# EAGLE design cougar_adapter (EAGLE 7.1.0)
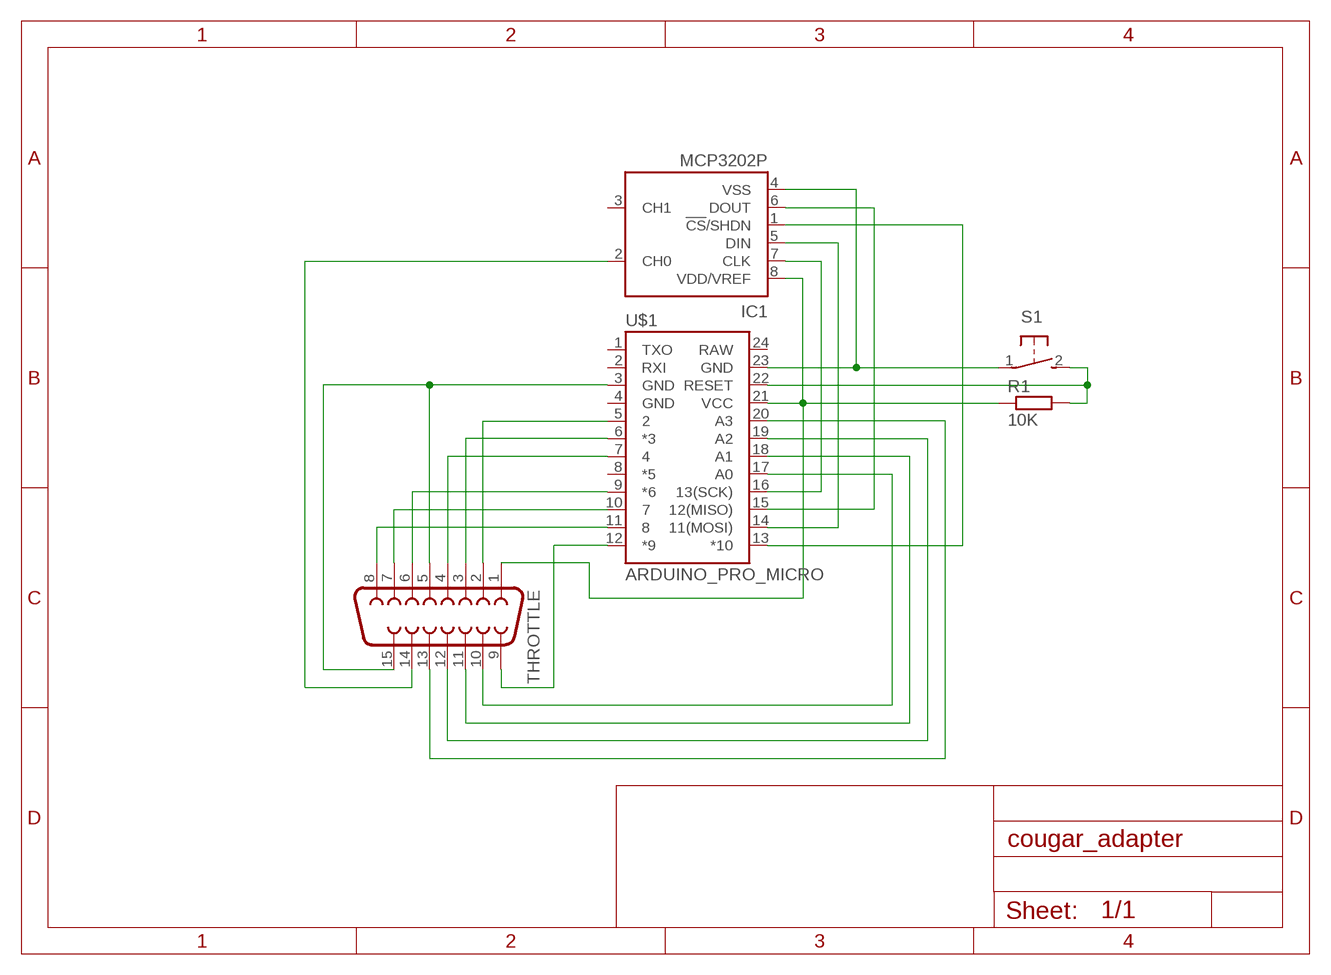
[diagram p0: schematic, sheet 1]

## Parts
IC1  MCP3202P  [DIL8]
R1  10K  R-EU_0204/7  [0204/7]
S1  31-XX  [B3F-31XX]
THROTTLE  F15HDH  [HDF15H]
U$1  ARDUINO_PRO_MICRO  [ARDUINO_PRO_MICRO]

## Nets
5V [Power]: IC1.8(VDD/VREF) R1.1 THROTTLE.1 U$1.21(VCC)
GND [Power]: IC1.4(VSS) S1.1(P) THROTTLE.5 THROTTLE.15 U$1.3(GND) U$1.23(GND)
N$2: IC1.5(DIN) U$1.14(11(MOSI))
N$3: IC1.6(DOUT) U$1.15(12(MISO))
N$4: IC1.7(CLK) U$1.16(13(SCK))
N$6: R1.2 S1.2(S) U$1.22(RESET)
N$7: THROTTLE.8 U$1.11
N$8: THROTTLE.7 U$1.10
N$9: THROTTLE.6 U$1.9(*6)
N$11: THROTTLE.4 U$1.7
N$12: THROTTLE.3 U$1.6(*3)
N$14: IC1.2(CH0) THROTTLE.14
N$15: THROTTLE.9 U$1.12(*9)
N$16: THROTTLE.2 U$1.5
N$17: THROTTLE.10 U$1.17(A0)
N$18: THROTTLE.11 U$1.18(A1)
N$19: THROTTLE.12 U$1.19(A2)
N$20: THROTTLE.13 U$1.20(A3)
N$21: IC1.1(!CS!/SHDN) U$1.13(*10)
Unconnected: IC1.3(CH1) U$1.1(TXO) U$1.2(RXI) U$1.4(GND) U$1.8(*5) U$1.24(RAW)

## Library data of the parts
IC1 = microchip:MCP3202: 2.7V Dual Channel 12-Bit A/D Converter with SPI Serial Interface Source: http://ww1.microchip.com/downloads/en/DeviceDoc/21034D.pdf; MF: MICROCHIP; MPN: MCP3202-CI/P; OC_FARNELL: 1196794; OC_NEWARK: 72K7287
R1 = resistor:R-EU_: RESISTOR, European symbol
S1 = adafruit:31-XX: OMRON SWITCH Now with beefier pads!
THROTTLE = adafruit:F15: SUB-D HDH is also known as a 'right angle VGA' connector
U$1 = SparkFun-Boards:ARDUINO_PRO_MICRO

## Net classes
0 default: width 0.254 mm, drill 0.254 mm, clearance 0.254 mm
1 Power: width 0.406 mm, drill 0.406 mm, clearance 0.406 mm

## Board
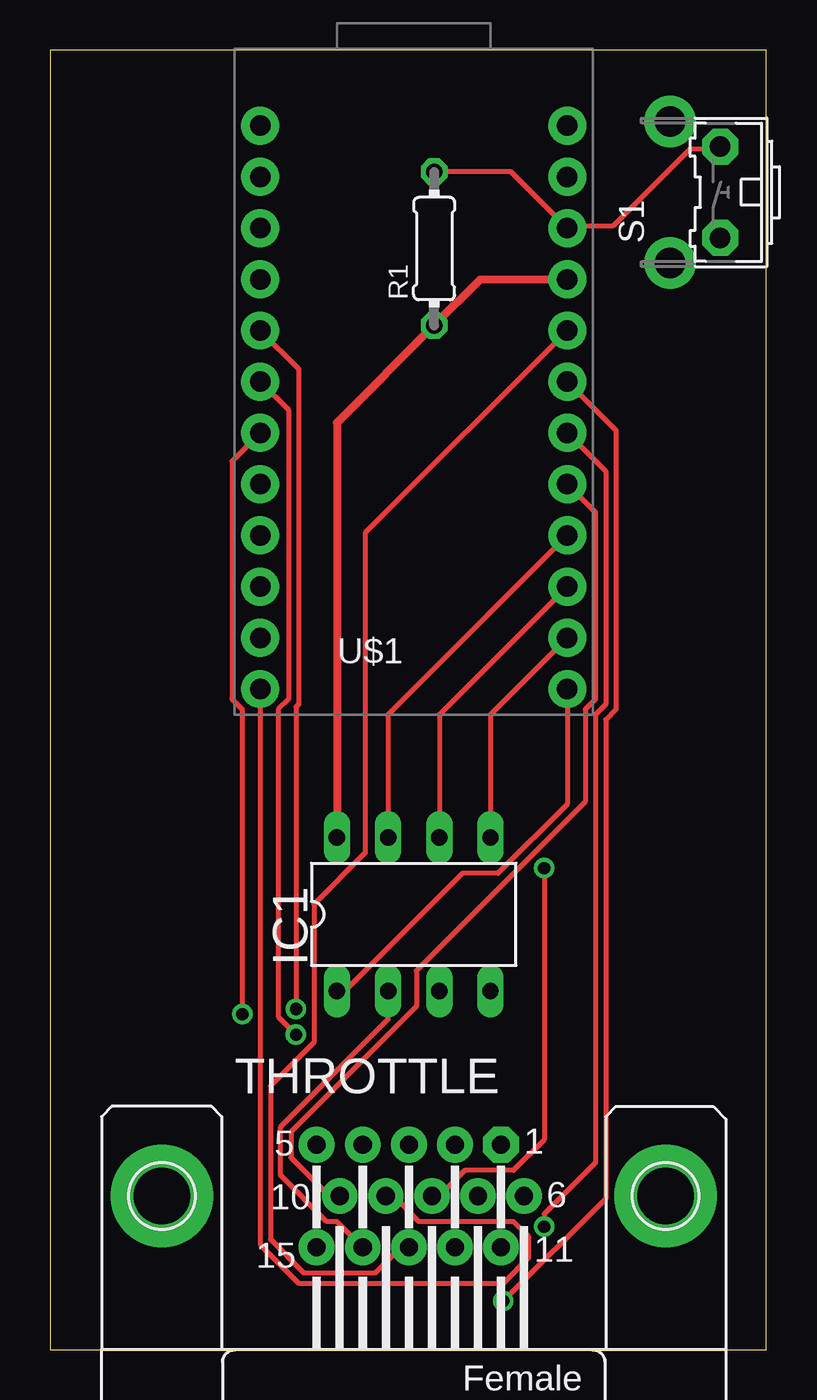
[diagram p1: board, top side]
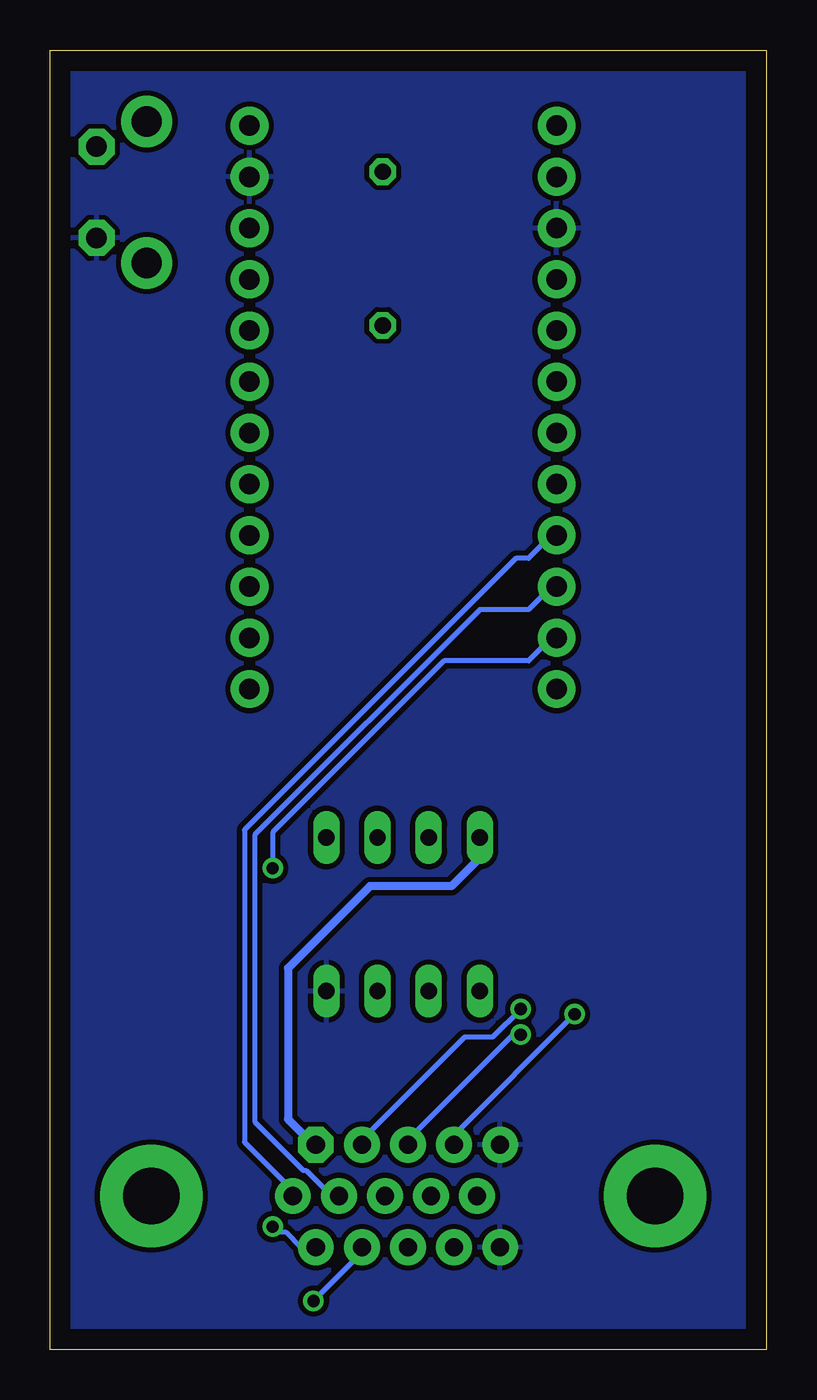
[diagram p2: board, bottom side, seen from below]

Size 35.54 x 64.44 mm. Coordinates in mm from the lower left corner, seen from the top.
Outline: 0,0 35.54,0 35.54,64.44 0,64.44 0,0
Copper layers (1*16): Top 0.035mm / dielectric 1.5mm / Bottom 0.035mm
Design rules "default": minimum track width 10mil, minimum drill 24mil, track to track 8mil, track to pad 8mil, pad to pad 8mil, via to via 8mil, smd to smd 8mil, copper to edge 40mil, drill to drill 8mil, minimum pad ring 10mil, minimum via ring 8mil, stop-mask expansion 4mil, vias tented up to drill 0mil, thermal gap 10mil

### Footprints (pad centres in the part's own frame; a part is rotated, then mirrored left to right if it is on the bottom)
DIL8 = drill 0.813 long: 1 -3.81,-3.81; 2 -1.27,-3.81; 3 1.27,-3.81; 4 3.81,-3.81; 5 3.81,3.81; 6 1.27,3.81; 7 -1.27,3.81; 8 -3.81,3.81
0204/7 = drill 0.813 octagon: 1 -3.81,0; 2 3.81,0
B3F-31XX = drill 1.016 pad 1.778 octagon: 1 -2.261,-1.245; 2 2.261,-1.245 | drill 1.499 pad 2.54: 3 -3.505,1.245; 4 3.505,1.245
HDF15H = drill 0.9 pad 1.778 octagon: 1 4.329,2.54 | drill 0.9 pad 1.778: 2 2.043,2.54; 3 -0.243,2.54; 4 -2.529,2.54; 5 -4.815,2.54; 6 5.472,0; 7 3.186,0; 8 0.9,0; 9 -1.386,0; 10 -3.672,0; 11 4.329,-2.54; 12 2.043,-2.54; 13 -0.243,-2.54; 14 -2.529,-2.54; 15 -4.815,-2.54 | drill 2.8 pad 5.08: P$1 -12.5,0; P$2 12.5,0
ARDUINO_PRO_MICRO = drill 1.016 pad 1.88: 1 -7.62,12.7; 2 -7.62,10.16; 3 -7.62,7.62; 4 -7.62,5.08; 5 -7.62,2.54; 6 -7.62,0; 7 -7.62,-2.54; 8 -7.62,-5.08; 9 -7.62,-7.62; 10 -7.62,-10.16; 11 -7.62,-12.7; 12 -7.62,-15.24; 13 7.62,-15.24; 14 7.62,-12.7; 15 7.62,-10.16; 16 7.62,-7.62; 17 7.62,-5.08; 18 7.62,-2.54; 19 7.62,0; 20 7.62,2.54; 21 7.62,5.08; 22 7.62,7.62; 23 7.62,10.16; 24 7.62,12.7

### Placement (x,y rotation side)
IC1  18.03,21.59 0 top
R1  19.05,54.61 90 top
S1  32,57.4 90 top
THROTTLE  18.03,7.62 0 top
U$1  18.03,48.01 0 top

### Tracks (layer width: path | path; a pad name or v marks a point on that pad's centre or on a via)
5V
  Top 0.406: IC1.8 14.22,45.97 R1.1 21.34,53.09 U$1.21
  Bottom 0.406: IC1.8 14.22,24.38 15.62,22.99 19.68,22.99 23.75,18.92 23.75,11.43 22.48,10.16 THROTTLE.1
GND
  pour Bottom: -2.79,66.04 38.86,66.04 38.86,-4.83 -4.06,-4.83 -4.06,65.53
N$2
  Top 0.254: IC1.5 21.84,31.5 U$1.14
N$3
  Top 0.254: IC1.6 19.3,31.5 U$1.15
N$4
  Top 0.254: IC1.7 16.76,31.5 U$1.16
N$6
  Top 0.254: R1.2 22.86,58.42 U$1.22 25.65,55.75 27.94,55.75 31.75,59.56 33.15,59.56 S1.2
N$7  (via drill 0.61)
  Top 0.254: THROTTLE.8 19.3,7.62 20.57,8.89 22.99,8.89 24.51,10.41 v24.51,23.88
  Bottom 0.254: v24.51,23.88 24.51,25.65 16,34.16 11.81,34.16 10.67,35.31 U$1.11
N$8
  Bottom 0.254: THROTTLE.7 21.59,7.62 22.86,8.89 22.99,8.89 25.4,11.3 25.4,25.53 14.22,36.7 11.81,36.7 10.67,37.85 U$1.10
N$9
  Bottom 0.254: U$1.9 10.67,40.39 11.81,39.24 12.45,39.24 25.91,25.78 25.91,10.29 23.62,8 23.62,7.62 THROTTLE.6
N$11  (via drill 0.61)
  Top 0.254: v9.53,16.64 9.53,31.75 9.02,32.26 9.02,44.07 U$1.7
  Bottom 0.254: v9.53,16.64 15.49,10.67 THROTTLE.4
N$12  (via drill 0.61)
  Top 0.254: v12.19,15.62 11.3,16.51 11.3,31.75 11.81,32.26 11.81,46.61 U$1.6
  Bottom 0.254: v12.19,15.62 12.57,15.62 17.78,10.41 THROTTLE.3
N$14
  Top 0.254: IC1.2 16.76,16.38 11.43,11.05 11.43,8.64 13.72,6.35 14.22,6.35 THROTTLE.14
N$15
  Top 0.254: THROTTLE.9 17.02,7.62 18.29,6.35 22.99,6.35 23.75,5.59 23.75,4.57 22.48,3.3 12.32,3.3 10.41,5.21 U$1.12
N$16  (via drill 0.61)
  Top 0.254: v12.19,16.89 12.19,31.88 12.32,32 12.32,48.64 U$1.5
  Bottom 0.254: v12.19,16.89 13.59,15.49 14.99,15.49 20.07,10.41 20.07,10.16 THROTTLE.2
N$17
  Top 0.254: THROTTLE.10 13.84,7.62 11.94,9.53 11.94,10.79 18.16,17.02 18.16,18.8 26.54,27.18 26.54,31.75 27.05,32.26 27.05,41.53 U$1.17
N$18  (via drill 0.61)
  Top 0.254: v24.51,6.1 24.51,6.73 27.05,9.27 27.05,31.5 27.56,32 27.56,43.56 U$1.18
  Bottom 0.254: THROTTLE.11 23.11,5.08 23.88,5.84 24.26,5.84 v24.51,6.1
N$19  (via drill 0.61)
  Top 0.254: v22.48,2.41 27.56,7.49 27.56,31.24 28.07,31.75 28.07,45.59 U$1.19
  Bottom 0.254: v22.48,2.41 20.19,4.7 20.19,5.08 THROTTLE.12
N$20
  Top 0.254: THROTTLE.13 17.4,5.08 16.13,3.81 12.57,3.81 10.92,5.46 10.92,13.08 13.08,15.24 13.08,22.1 15.62,24.64 15.62,40.51 U$1.20
N$21
  Top 0.254: IC1.1 14.61,17.78 20.45,23.62 22.23,23.62 25.65,27.05 U$1.13